# EAGLE design board (EAGLE 6.5.0)
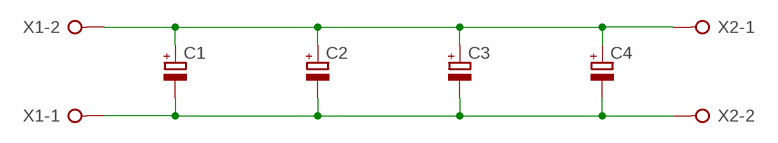
[diagram p0: schematic, sheet 1]

## Parts
C1  CPOL-EUE10-30  [EB30D]
C2  CPOL-EUE10-22.5  [EB22,5D]
C3  CPOL-EUE10-22.5  [EB22,5D]
C4  CPOL-EUE10-22.5  [EB22,5D]
X1  W237-02P  [W237-132]
X2  W237-02P  [W237-132]

## Nets
GND: C1.- C2.- C3.- C4.- X1.1 X2.2
V+: C1.+ C2.+ C3.+ C4.+ X1.2 X2.1

## Library data of the parts
C1-C4 = rcl:CPOL-EU: POLARIZED CAPACITOR, European symbol
X1 X2 = con-wago-508:W237-02P: WAGO SREW CLAMP; OC_FARNELL: unknown; OC_NEWARK: unknown

## Board
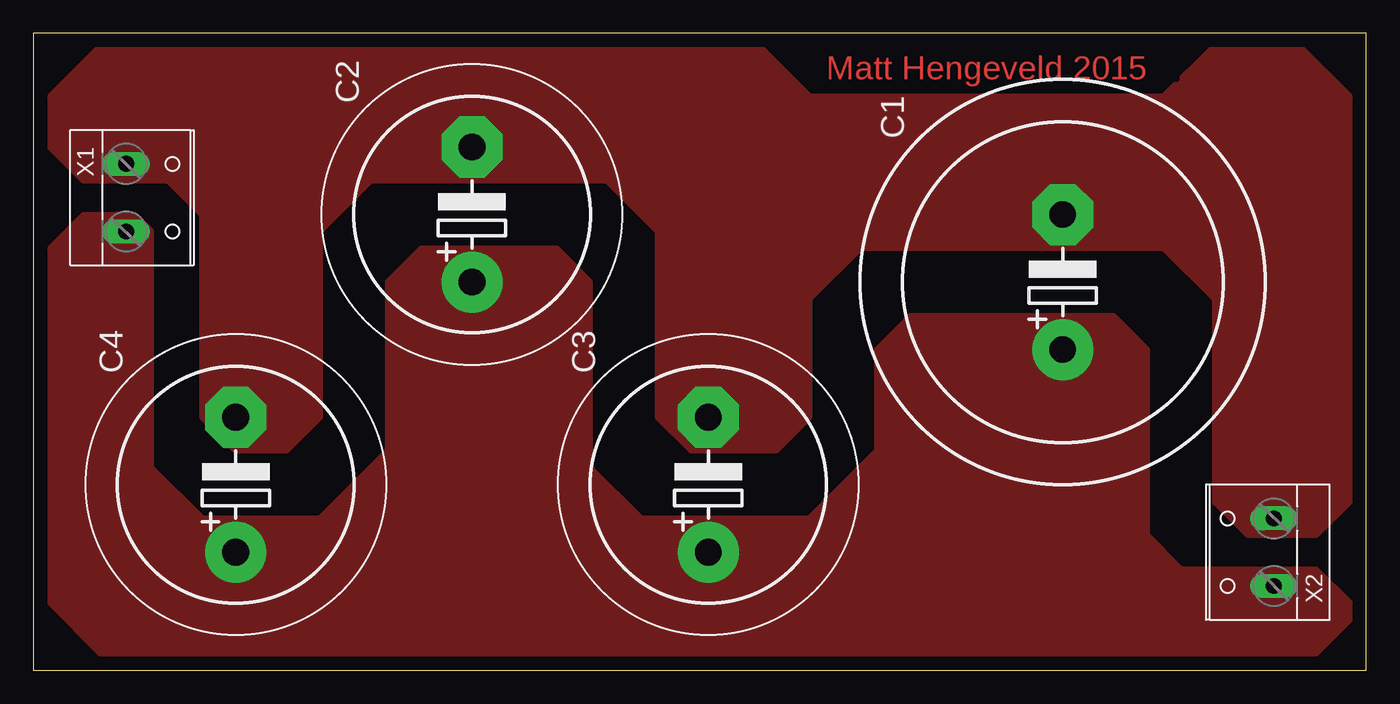
[diagram p1: board, top side]

Size 100.31 x 47.93 mm. Coordinates in mm from the lower left corner, seen from the top.
Outline: 0,0 100.31,0 100.31,47.93 0,47.93 0,0
Copper layers (1*16): Top 0.035mm / dielectric 1.5mm / Bottom 0.035mm
Design rules "default": minimum track width 10mil, minimum drill 24mil, track to track 8mil, track to pad 8mil, pad to pad 8mil, via to via 8mil, smd to smd 8mil, copper to edge 40mil, drill to drill 8mil, minimum pad ring 10mil, minimum via ring 8mil, stop-mask expansion 4mil, vias tented up to drill 0mil, thermal gap 10mil

### Footprints (pad centres in the part's own frame; a part is rotated, then mirrored left to right if it is on the bottom)
EB30D = drill 2.007 pad 4.597: + -5.08,0 | drill 2.007 pad 4.597 octagon: - 5.08,0
EB22,5D = drill 2.007 pad 4.597: + -5.08,0 | drill 2.007 pad 4.597 octagon: - 5.08,0
W237-132 = drill 1.194 long: 1 -2.54,-0.635; 2 2.54,-0.635

### Placement (x,y rotation side)
C1  77.47,29.21 90 top
C2  33.02,34.29 90 top
C3  50.8,13.97 90 top
C4  15.24,13.97 90 top
X1  7.62,35.56 270 top
X2  92.71,8.89 90 top

### Tracks (layer width: path | path; a pad name or v marks a point on that pad's centre or on a via)
GND
  pour Top (no thermals): 5.08,46.99 1.27,43.18 1.27,39.37 3.81,36.83 10.16,36.83 12.7,34.29 12.7,19.05 15.24,16.51 19.05,16.51 21.59,19.05 21.59,33.02 25.4,36.83 43.18,36.83 46.99,33.02 46.99,19.05 49.53,16.51 55.88,16.51 58.42,19.05 58.42,27.94 62.23,31.75 85.09,31.75 88.9,27.94 88.9,12.7 91.44,10.16 96.52,10.16 99.06,12.7 99.06,43.18 95.25,46.99 88.9,46.99 85.09,43.18 58.42,43.18 54.61,46.99
V+
  pour Top (no thermals): 1.27,31.75 3.81,34.29 7.62,34.29 8.89,33.02 8.89,15.24 12.7,11.43 21.59,11.43 26.67,16.51 26.67,29.21 29.21,31.75 39.37,31.75 41.91,29.21 41.91,15.24 45.72,11.43 58.42,11.43 63.5,16.51 63.5,24.13 66.04,26.67 81.28,26.67 83.82,24.13 83.82,10.16 86.36,7.62 96.52,7.62 99.06,5.08 99.06,3.81 96.52,1.27 5.08,1.27 1.27,5.08

### Text on the board
Top: Matt Hengeveld 2015